# EAGLE design i2c-hub (EAGLE 6.4)
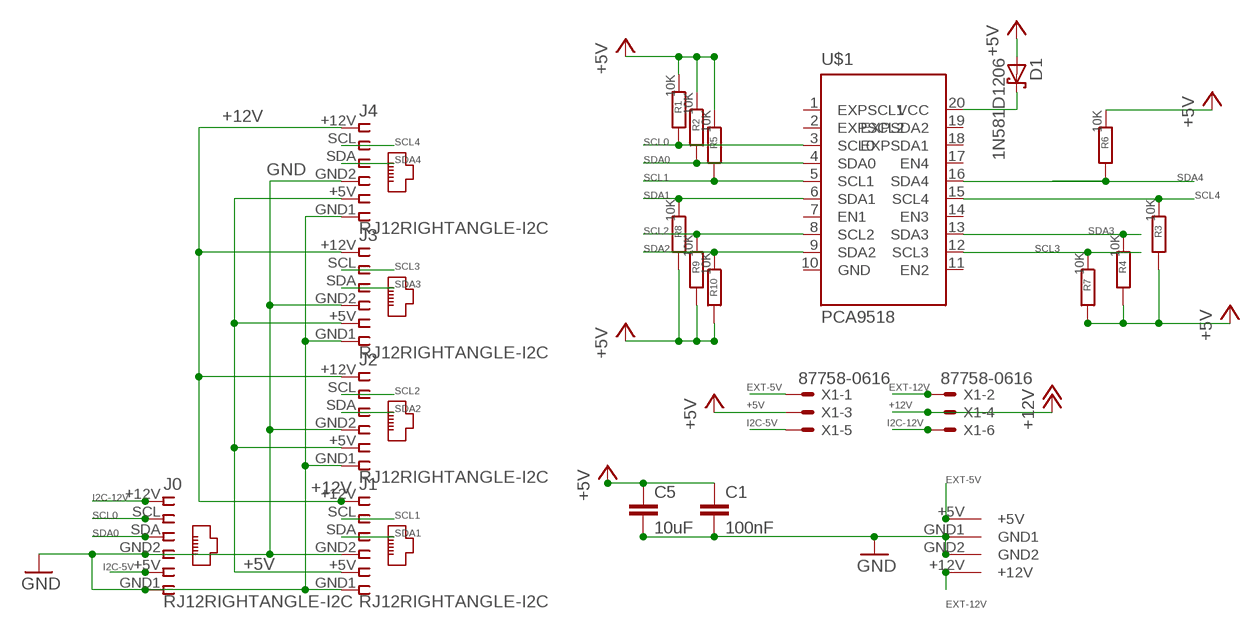
[diagram p0: schematic, sheet 1]

## Parts
C1  100nF  C-EUC1206  [C1206]
C5  10uF  C-EUC1206  [C1206]
D1  1N581D1206  [LED-1206]
J0  RJ12RIGHTANGLE-I2C  [RJ12-RIGHTANGLE-I2C]
J1  RJ12RIGHTANGLE-I2C  [RJ12-RIGHTANGLE-I2C]
J2  RJ12RIGHTANGLE-I2C  [RJ12-RIGHTANGLE-I2C]
J3  RJ12RIGHTANGLE-I2C  [RJ12-RIGHTANGLE-I2C]
J4  RJ12RIGHTANGLE-I2C  [RJ12-RIGHTANGLE-I2C]
R1  10K  R-EU_M1206  [M1206]
R2  10K  R-EU_M1206  [M1206]
R3  10K  R-EU_M1206  [M1206]
R4  10K  R-EU_M1206  [M1206]
R5  10K  R-EU_M1206  [M1206]
R6  10K  R-EU_M1206  [M1206]
R7  10K  R-EU_M1206  [M1206]
R8  10K  R-EU_M1206  [M1206]
R9  10K  R-EU_M1206  [M1206]
R10  10K  R-EU_M1206  [M1206]
U$1  PCA9518  [SO20W]
U$2  KPJX-4S-S  [KPJX-4S-S]
X1  87758-0616  [87758-0616]

## Nets
+5V: C1.1 C5.1 D1.A J1.+5V J2.+5V J3.+5V J4.+5V R1.1 R2.1 R3.2 R4.2 R5.1 R6.1 R7.2 R8.2 R9.2 R10.2 X1.3
+5V1 [power]: D1.C U$1.20(VCC)
+12V: J1.+12V J2.+12V J3.+12V J4.+12V X1.4
EXT-5V [highpower]: U$2.+5V X1.1
EXT-12V [highpower]: U$2.+12V X1.2
GND [power]: C1.2 C5.2 J0.GND1 J0.GND2 J1.GND1 J1.GND2 J2.GND1 J2.GND2 J3.GND1 J3.GND2 J4.GND1 J4.GND2 U$2.GND1 U$2.GND2
I2C-5V [power]: J0.+5V X1.5
I2C-12V: J0.+12V X1.6
SCL0: J0.SCL R1.2 U$1.3(SCL0)
SCL1: J1.SCL R5.2 U$1.5(SCL1)
SCL2: J2.SCL R9.1 U$1.8(SCL2)
SCL3: J3.SCL R7.1 U$1.12(SCL3)
SCL4: J4.SCL R3.1 U$1.15(SCL4)
SDA0: J0.SDA R2.2 U$1.4(SDA0)
SDA1: J1.SDA R8.1 U$1.6(SDA1)
SDA2: J2.SDA R10.1 U$1.9(SDA2)
SDA3: J3.SDA R4.1 U$1.13(SDA3)
SDA4: J4.SDA R6.2 U$1.16(SDA4)
Unconnected: U$1.1(EXPSCL1) U$1.2(EXPSCL2) U$1.7(EN1) U$1.11(EN2) U$1.14(EN3) U$1.17(EN4) U$1.18(EXPSDA1) U$1.19(EXPSDA2)

## Power pins joined to a net without a drawn wire
GND: U$1.10(GND)

## Library data of the parts
C1 C5 = rcl:C-EU: CAPACITOR, European symbol
D1 = lpatiny:1N581*: 1.0A SCHOTTKY BARRIER RECTIFIER Source: http://www.diodes.com/datasheets/ds23001.pdf
J0 J1-J4 = lpatiny:RJ12: CORCOM Modular RJ Jacks No Shield Source: www.tycoelectronics.com .. ENG_DS_1654001_1099_RJ_L_0507.pdf
R1-R10 = resistor:R-EU_: RESISTOR, European symbol
U$1 = lpatiny:PCA9518
U$2 = lpatiny:KPJX-4S-S
X1 = con-molex:87758-0616: 6 Pin - 2mm Dual Row Single Wafer, Vertical T/H HDR Source: http://www.molex.com/pdm_docs/sd/877580616_sd.pdf; MPN: 87758-0616; OC_FARNELL: 7472323; OC_NEWARK: 25M5667

## Net classes
0 default: width 0.457 mm
1 power: width 0.457 mm
2 highpower: width 1.372 mm
3 fine: width 0.457 mm

## Board
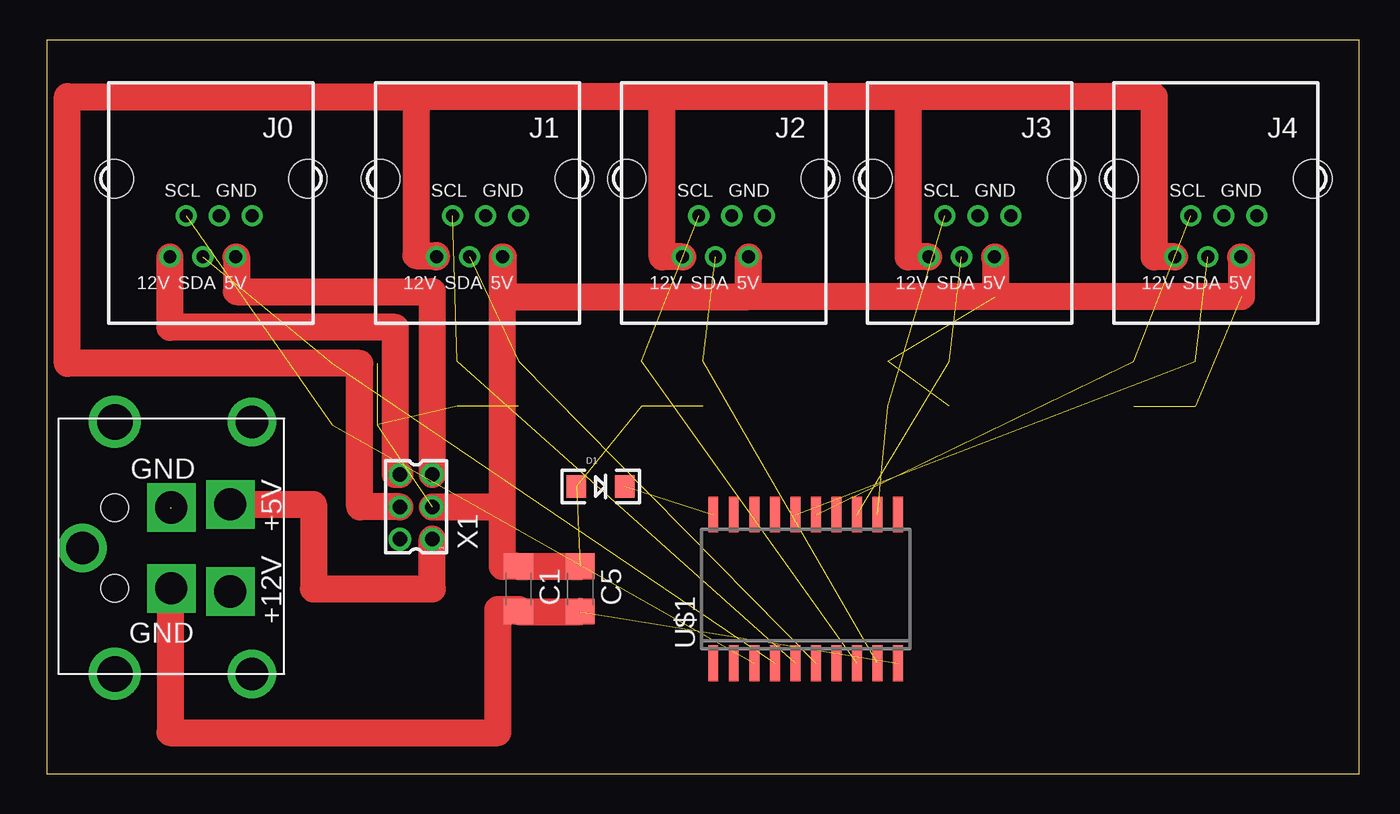
[diagram p1: board, top side]
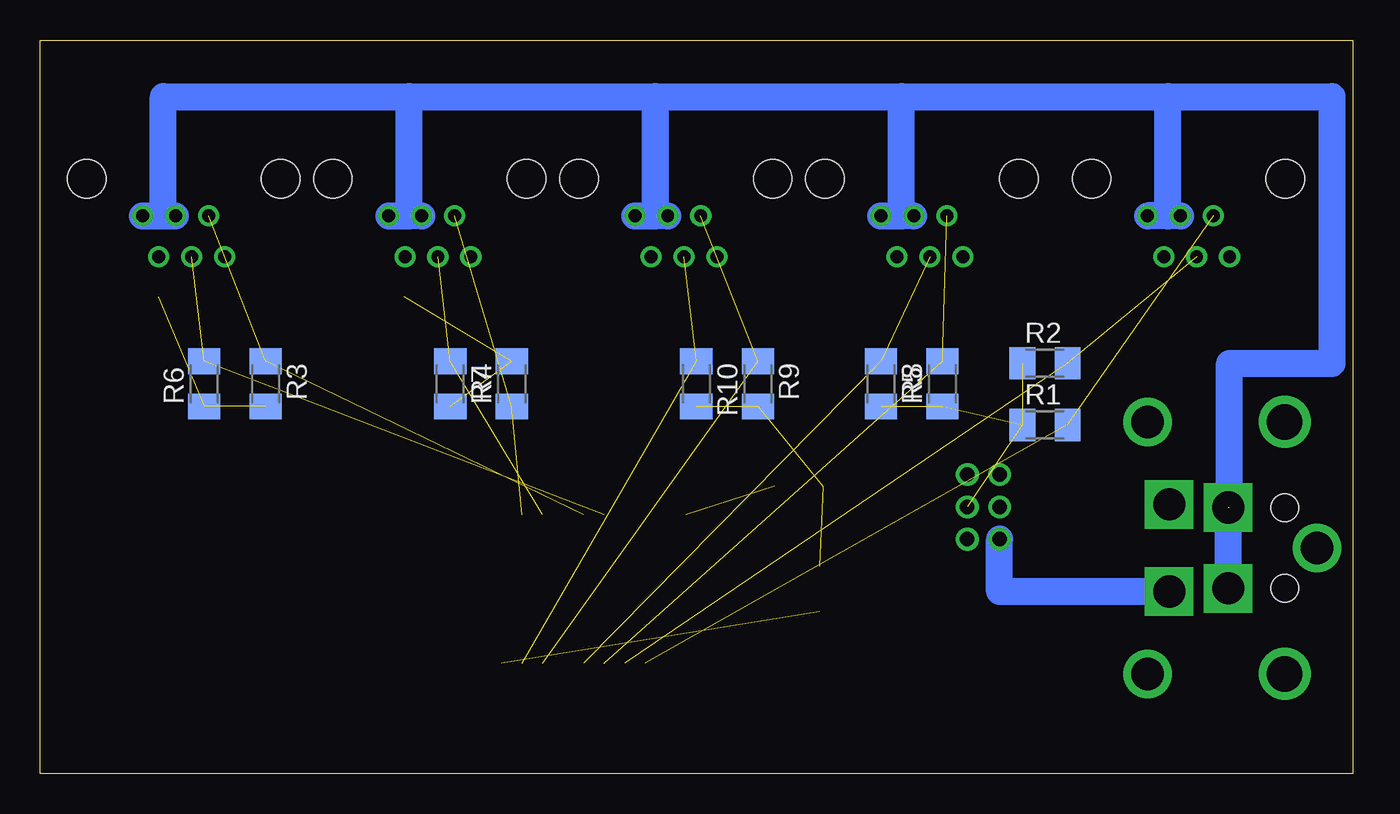
[diagram p2: board, bottom side, seen from below]

Size 81.27 x 45.39 mm. Coordinates in mm from the lower left corner, seen from the top.
Outline: 0,0 81.27,0 81.27,45.39 0,45.39 0,0
Copper layers (1*16): Top 0.035mm / dielectric 1.5mm / Bottom 0.035mm
Design rules "default": minimum track width 6mil, minimum drill 12mil, track to track 6mil, track to pad 6mil, pad to pad 6mil, via to via 6mil, smd to smd 0mil, copper to edge 10mil, drill to drill 10mil, minimum pad ring 10mil, minimum via ring 6mil, stop-mask expansion 2mil, vias tented up to drill 100mil, thermal gap 10mil
vRestrict: area 39.4,3.8 to 54.6,19.1

### Footprints (pad centres in the part's own frame; a part is rotated, then mirrored left to right if it is on the bottom)
C1206 = smd 1.6 x 1.8: 1 -1.4,0; 2 1.4,0
LED-1206 = smd 1.2 x 1.4: A -1.5,0; C 1.5,0
RJ12-RIGHTANGLE-I2C = drill 0.8 pad 1.3: +5V -1.54,4.84; +12V 2.54,4.84; GND1 -2.54,2.3; GND2 -0.5,2.3; SCL 1.54,2.3; SDA 0.5,4.84 | hole 2.36: -6,0; 6,0
M1206 = smd 1.6 x 2: 1 -1.4,0; 2 1.4,0
SO20W = smd 0.6 x 2.2: 1 -5.715,-4.6; 2 -4.445,-4.6; 3 -3.175,-4.6; 4 -1.905,-4.6; 5 -0.635,-4.6; 6 0.635,-4.6; 7 1.905,-4.6; 8 3.175,-4.6; 9 4.445,-4.6; 10 5.715,-4.6; 11 5.715,4.6; 12 4.445,4.6; 13 3.175,4.6; 14 1.905,4.6; 15 0.635,4.6; 16 -0.635,4.6; 17 -1.905,4.6; 18 -3.175,4.6; 19 -4.445,4.6; 20 -5.715,4.6
KPJX-4S-S = drill 2 square: +5V 2.7,1.35; +12V -2.7,1.35; GND1 -2.5,5; GND2 2.5,5 | drill 2: P$1 -7.8,0; P$2 7.8,0; P$11 0,10.5 | drill 2.2: P$3 -7.8,8.5; P$4 7.8,8.5 | hole 1.7: -2.5,8.5; 2.5,8.5
87758-0616 = drill 0.9 pad 1.27: 1 -2,-1; 2 -2,1; 3 0,-1; 4 0,1; 5 2,-1; 6 2,1

### Placement (x,y rotation side)
C1  29.21,11.43 270 top
C5  33.02,11.43 270 top
D1  34.29,17.78 0 top
J0  10.16,36.83 180 top
J1  26.67,36.83 180 top
J2  41.91,36.83 180 top
J3  57.15,36.83 180 top
J4  72.39,36.83 180 top
R1  19.05,21.59 0 bottom
R2  19.05,25.4 0 bottom
R3  67.31,24.13 270 bottom
R4  55.88,24.13 270 bottom
R5  25.4,24.13 90 bottom
R6  71.12,24.13 90 bottom
R7  52.07,24.13 90 bottom
R8  29.21,24.13 270 bottom
R9  36.83,24.13 270 bottom
R10  40.64,24.13 270 bottom
U$1  46.99,11.43 0 top
U$2  12.7,13.97 90 top
X1  22.86,16.51 90 top

### Tracks (layer width: path | path; a pad name or v marks a point on that pad's centre or on a via)
+5V  (11 unrouted)
  Top 1.676: X1.3 28.21,16.51 | 28.21,16.51 J1.+5V 28.26,31.99 28.26,29.53 43.45,29.53 | 43.45,29.53 J2.+5V | J3.+5V 58.74,31.99 58.74,29.53 | 58.74,29.53 43.45,29.53 | J4.+5V 73.98,31.99 73.98,29.53 58.74,29.53 | 28.21,16.51 28.21,12.83 C1.1 C5.1
+5V1  (1 unrouted)
+12V
  Top 1.676: X1.4 19.37,16.51 19.37,25.4 1.27,25.4 1.27,41.91 22.86,41.91 | 22.86,41.91 22.86,32.07 24.13,32.07 J1.+12V | J2.+12V 38.1,31.99 38.1,41.91 | 38.1,41.91 22.86,41.91 | J3.+12V 53.34,31.99 53.34,41.91 | 53.34,41.91 38.1,41.91 | J4.+12V 68.58,31.99 68.58,41.91 53.34,41.91
EXT-5V
  Top 1.676: U$2.+5V 16.51,16.67 16.51,11.43 23.86,11.43 X1.1
EXT-12V
  Bottom 1.676: U$2.+12V 21.86,11.27 X1.2
GND  (2 unrouted)
  Top 1.676: U$2.GND1 7.62,11.47 7.62,2.54 27.94,2.54 27.94,10.16 29.21,10.16 C1.2 C5.2
  Bottom 1.676: 7.62,16.47 7.62,25.4 1.27,25.4 1.27,41.91 11.43,41.91 | J0.GND1 J0.GND2 11.43,34.53 11.43,41.91 | J1.GND1 27.94,34.53 | J1.GND2 27.94,34.53 | 27.94,34.53 27.94,41.91 | 27.94,41.91 11.43,41.91 | J2.GND1 43.18,34.53 | J2.GND2 43.18,34.53 | 43.18,34.53 43.18,41.91 | 43.18,41.91 27.94,41.91 | J3.GND1 58.42,34.53 | J3.GND2 58.42,34.53 | 58.42,34.53 58.42,41.91 | 58.42,41.91 43.18,41.91 | J4.GND1 J4.GND2 73.66,34.53 73.66,41.91 58.42,41.91 | U$2.GND1 U$2.GND2
I2C-5V
  Top 1.676: J0.+5V 11.75,31.99 11.75,29.84 23.86,29.84 X1.5
I2C-12V
  Top 1.676: X1.6 21.59,18.51 21.59,27.62 7.62,27.62 J0.+12V
SCL0  (2 unrouted)
SCL1  (2 unrouted)
SCL2  (2 unrouted)
SCL3  (2 unrouted)
SCL4  (2 unrouted)
SDA0  (2 unrouted)
SDA1  (2 unrouted)
SDA2  (2 unrouted)
SDA3  (2 unrouted)
SDA4  (2 unrouted)